# Altium schematic sheet 03_Boost.SchDoc
size A4
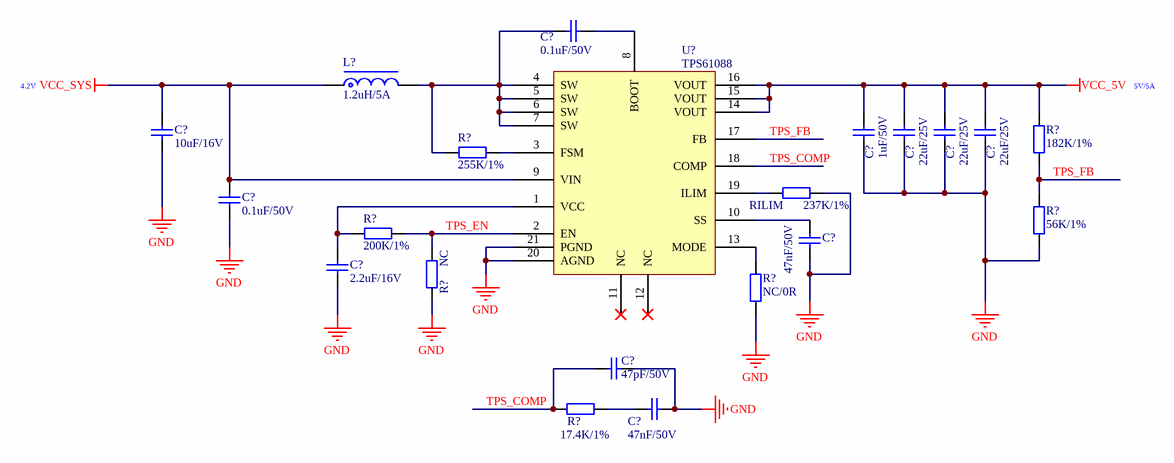
[diagram p0: 03_Boost.SchDoc]

## Parts
(Parts that share a designator on the sheet are numbered #1, #2 ... from top to bottom, then left to right.)
C?#1  0.1uF/50V  [C0402_L]
C?#2  10uF/16V  [C0805_L]
C?#3  1uF/50V  [C0603_L]
C?#4  22uF/25V  [C1206_L]
C?#5  22uF/25V  [C1206_L]
C?#6  22uF/25V  [C1206_L]
C?#7  0.1uF/50V  [C0805_L]
C?#8  47nF/50V  [C0603_L]
C?#9  2.2uF/16V  [C0603_L]
C?#10  47pF/50V  [C0603_L]
C?#11  47nF/50V  [C0603_L]
L?  1.2uH/5A  [CDRH73]
R?#1  255K/1%  [R0603_L]
R?#2  182K/1%  [R0603_L]
R?#3  200K/1%  [R0603_L]
R?#4  56K/1%  [R0603_L]
R?#5  NC  [R0603_L]
R?#6  NC/0R  [R0603_L]
R?#7  17.4K/1%  [R0603_L]
RILIM  237K/1%  [R0603_L]
U?  TPS61088  [VQFN-20]

## Nets
GND: C?#2.1 C?#3.1 C?#4.1 C?#5.1 C?#6.1 C?#7.1 C?#8.1 C?#9.1 C?#10.2 C?#11.2 R?#4.1 R?#5.1 R?#6.1 RILIM.2 U?.20(AGND) U?.21(PGND)
VCC_5V: C?#3.2 C?#4.2 C?#5.2 C?#6.2 R?#2.2 U?.14(VOUT) U?.15(VOUT) U?.16(VOUT)
VCC_SYS: C?#2.2 C?#7.2 L?.1 U?.9(VIN)
TPS_COMP: C?#10.1 R?#7.1 U?.18(COMP)
TPS_EN: R?#3.2 R?#5.2 U?.2(EN)
TPS_FB: R?#2.1 R?#4.2 U?.17(FB)
NetC?#1_1: C?#1.1 L?.2 R?#1.1 U?.4(SW) U?.5(SW) U?.6(SW) U?.7(SW)
NetC?#1_2: C?#1.2 U?.8(BOOT)
NetC?#8_2: C?#8.2 U?.10(SS)
NetC?#9_2: C?#9.2 R?#3.1 U?.1(VCC)
NetC?#11_1: C?#11.1 R?#7.2
NetR?#1_2: R?#1.2 U?.3(FSM)
NetR?#6_2: R?#6.2 U?.13(MODE)
NetRILIM_1: RILIM.1 U?.19(ILIM)

Not connected (* = marked no-connect by the designer): U? 11(NC)* 12(NC)*

## Notes on the sheet
- 4.2V
- 5V/5A

## Library data of the parts
C?#1-C?#11 = C: 贴片电容; BOM名称: 无极性贴片电容; 联系卖家，免费查找封装: 唯一出售店铺网址https://shop463601444.taobao.com
L? = L-CDRH: 功率电感; BOM名称: 功率屏蔽电感; 联系卖家，免费查找封装: 唯一出售店铺网址https://shop463601444.taobao.com
R?#1-R?#7 RILIM = R: 贴片电阻; 联系卖家，免费查找封装: 唯一出售店铺网址https://shop463601444.taobao.com; BOM名称: 贴片电阻
U? = TPS61088: 10A 全集成同步升压转换器